# Altium project Dustbike_Core.PrjPcb
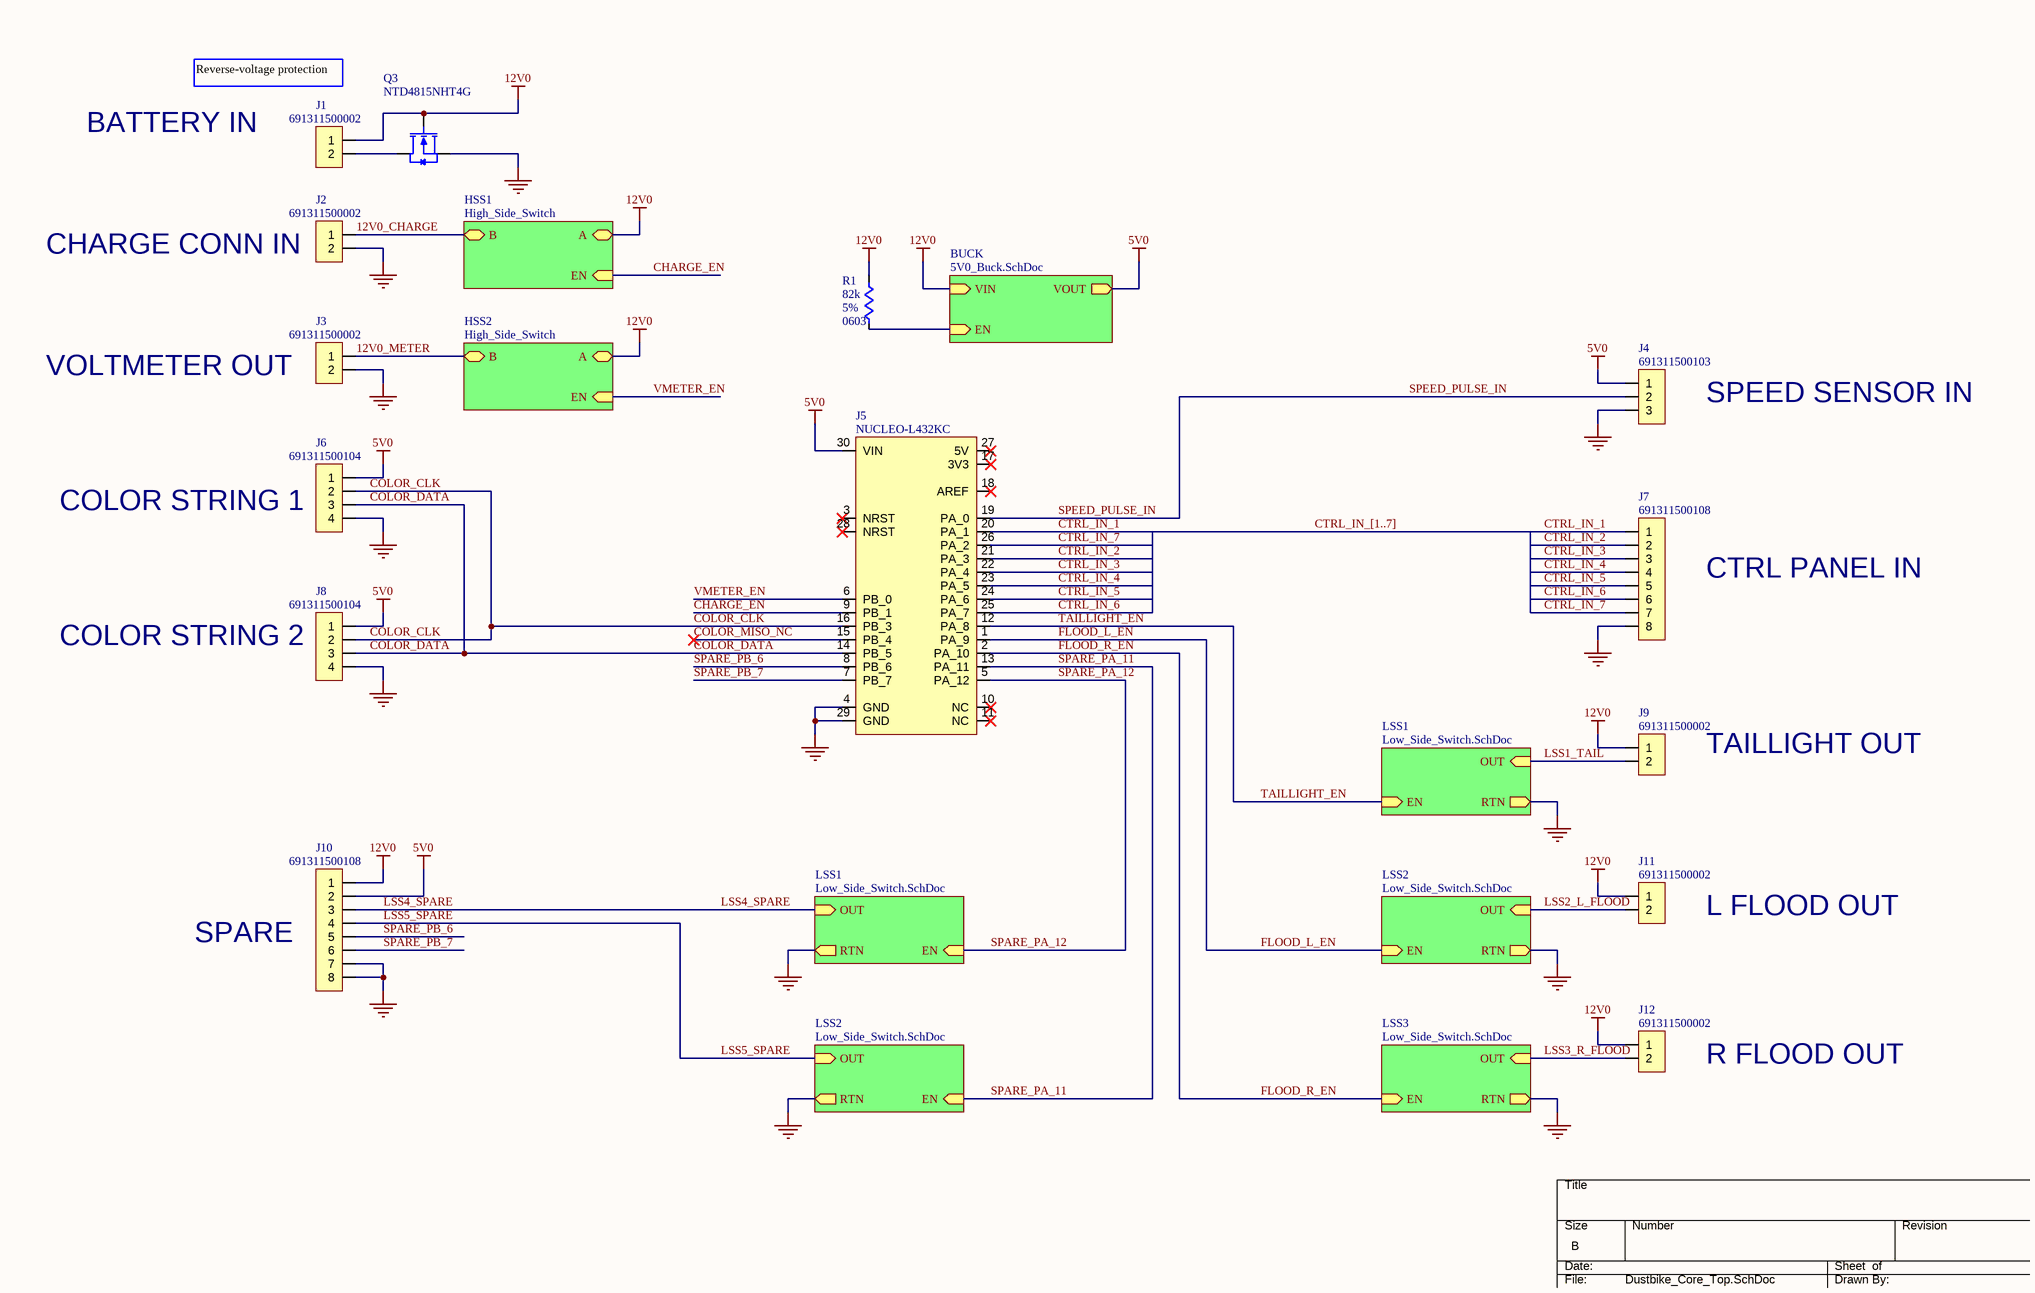
[diagram p0: Dustbike_Core_Top.SchDoc]
4 sheets, 41 parts. Net scope: hierarchical (ports join the sheet entries above them; power ports are global).
Board file: Dustbike_Core.PcbDoc
Sheets:
  Dustbike_Core_Top.SchDoc
    BUCK = 5V0_Buck.SchDoc
    LSS1 = Low_Side_Switch.SchDoc
    LSS2 = Low_Side_Switch.SchDoc
    LSS3 = Low_Side_Switch.SchDoc
    LSS1 = Low_Side_Switch.SchDoc
    LSS2 = Low_Side_Switch.SchDoc
    HSS1 = High_Side_Switch.SchDoc
    HSS2 = High_Side_Switch.SchDoc

## Sheet Dustbike_Core_Top.SchDoc: Edit Title in Document Parameters
size B; Address1: # and Street; Address2: City, State, Zip; Address3: Phone#; Address4: USA; DocumentNumber: 1; SheetNumber: 1; SheetTotal: 4; CompanyName: CompanyName; TemplateRev: D-PCD-0111-01

### Parts
J1  Manufacturer Part Number 1: 691311500002  [WURTH_691311500002]  (hidden comment: HDR_2POS)
J2  Manufacturer Part Number 1: 691311500002  [WURTH_691311500002]  (hidden comment: HDR_2POS)
J3  Manufacturer Part Number 1: 691311500002  [WURTH_691311500002]  (hidden comment: HDR_2POS)
J4  Manufacturer Part Number 1: 691311500103  [WURTH_691311500103]  (hidden comment: HDR_3POS)
J5  Manufacturer Part Number 1: NUCLEO-L432KC  [NANO_HEADER]  (hidden comment: NUCLEO_NANO)
J6  Manufacturer Part Number 1: 691311500104  [WURTH_691311500104]  (hidden comment: HDR_4POS)
J7  Manufacturer Part Number 1: 691311500108  [WURTH_691311500108]  (hidden comment: HDR_8POS)
J8  Manufacturer Part Number 1: 691311500104  [WURTH_691311500104]  (hidden comment: HDR_4POS)
J9  Manufacturer Part Number 1: 691311500002  [WURTH_691311500002]  (hidden comment: HDR_2POS)
J10  Manufacturer Part Number 1: 691311500108  [WURTH_691311500108]  (hidden comment: HDR_8POS)  (no BOM)
J11  Manufacturer Part Number 1: 691311500002  [WURTH_691311500002]  (hidden comment: HDR_2POS)
J12  Manufacturer Part Number 1: 691311500002  [WURTH_691311500002]  (hidden comment: HDR_2POS)
Q3  Manufacturer Part Number 1: NTD4815NHT4G  [DPAK228P991X238-3N_NTD4815NHT4G]  (hidden comment: NFET_SOT323)
R1  value 82k  Tolerance: 5%  Package: 0603  [RESC1508X09N]  (hidden comment: RES)

### Sub-sheets
BUCK = 5V0_Buck.SchDoc: VIN (in), VOUT (out), EN (in)
HSS1 = High_Side_Switch: A (bidir), B (bidir), EN (in)
HSS2 = High_Side_Switch: A (bidir), B (bidir), EN (in)
LSS1 = Low_Side_Switch.SchDoc: OUT (in), RTN (out), EN (in)
LSS1 = Low_Side_Switch.SchDoc: OUT (in), RTN (out), EN (in)
LSS2 = Low_Side_Switch.SchDoc: OUT (in), RTN (out), EN (in)
LSS2 = Low_Side_Switch.SchDoc: OUT (in), RTN (out), EN (in)
LSS3 = Low_Side_Switch.SchDoc: OUT (in), RTN (out), EN (in)

### Nets
5V0: J4.1 J5.30(VIN) J6.1 J8.1 J10.2 ; sheet BUCK/VOUT
12V0: J1.1 J9.1 J10.1 J11.1 J12.1 Q3.G R1.2 ; sheet BUCK/VIN, sheet HSS1/A, sheet HSS2/A
GND: J2.2 J3.2 J4.3 J5.4(GND) J5.29(GND) J6.4 J7.8 J8.4 J10.7 J10.8 Q3.S ; sheet LSS1/RTN, sheet LSS2/RTN, sheet LSS3/RTN, sheet LSS1/RTN, sheet LSS2/RTN
12V0_CHARGE: J2.1 ; sheet HSS1/B
12V0_METER: J3.1 ; sheet HSS2/B
CHARGE_EN: J5.9(PB_1) ; sheet HSS1/EN
COLOR_CLK: J5.16(PB_3) J6.2 J8.2
COLOR_DATA: J5.14(PB_5) J6.3 J8.3
COLOR_MISO_NC: J5.15(PB_4)
CTRL_IN_1: J5.20(PA_1) J7.1
CTRL_IN_2: J5.21(PA_3) J7.2
CTRL_IN_3: J5.22(PA_4) J7.3
CTRL_IN_4: J5.23(PA_5) J7.4
CTRL_IN_5: J5.24(PA_6) J7.5
CTRL_IN_6: J5.25(PA_7) J7.6
CTRL_IN_7: J5.26(PA_2) J7.7
FLOOD_L_EN: J5.1(PA_9) ; sheet LSS2/EN
FLOOD_R_EN: J5.2(PA_10) ; sheet LSS3/EN
LSS1_TAIL: J9.2 ; sheet LSS1/OUT
LSS2_L_FLOOD: J11.2 ; sheet LSS2/OUT
LSS3_R_FLOOD: J12.2 ; sheet LSS3/OUT
LSS4_SPARE: J10.3 ; sheet LSS1/OUT
LSS5_SPARE: J10.4 ; sheet LSS2/OUT
SPARE_PA_11: J5.13(PA_11) ; sheet LSS2/EN
SPARE_PA_12: J5.5(PA_12) ; sheet LSS1/EN
SPARE_PB_6: J5.8(PB_6) J10.5
SPARE_PB_7: J5.7(PB_7) J10.6
SPEED_PULSE_IN: J4.2 J5.19(PA_0)
TAILLIGHT_EN: J5.12(PA_8) ; sheet LSS1/EN
VMETER_EN: J5.6(PB_0) ; sheet HSS2/EN
NetJ1_2: J1.2 Q3.D
NetR1_1: R1.1 ; sheet BUCK/EN

Not connected (* = marked no-connect by the designer): J5 3(NRST)* 10(NC)* 11(NC)* 17(3V3)* 18(AREF)* 27(5V)* 28(NRST)*

### Buses and harness runs
bus CTRL_IN_[1..7]

### Notes on the sheet
- Reverse-voltage protection
- BATTERY IN
- CHARGE CONN IN
- VOLTMETER OUT
- SPEED SENSOR IN
- COLOR STRING 1
- CTRL PANEL IN
- COLOR STRING 2
- TAILLIGHT OUT
- SPARE
- L FLOOD OUT
- R FLOOD OUT
- 4
- 3
- 2
- 1
- D
- C
- B
- 1455 Market St., Ste 600
- A
- San Francisco, CA 94103
- WWW.SQUAREUP.COM
- SIZE
- TITLE
- PRINT DATE
- DRAWING NO.
- REVISION
- RELEASE/EDITION
- © SQUARE INC
- PROPRIETARY AND CONFIDENTIAL.
- ALL RIGHTS RESERVED. NO DUPLICATION, USE OR
- DISCLOSURES WITHOUT PRIOR WRITTEN APPROVAL.
- JIRA EPIC
- SHEET            OF

### Library data of the parts
J1-J3 J9 J11 J12 = GEN-CN-0001: TERM BLOCK HDR 2POS VERT 5.08MM; Manufacturer 1: Würth Elektronik; Connector Type: Header, Male Pins, Shrouded (2 Side); Gender: Male Pins; Number of Positions/Contacts: 2; Voltage - Rated: 300V; Current Rating: 20A; Body Color: Green; Manufacturer Part Number: *; TPN: GEN-CN-0001; Series: WR-TBL Series 3211; Mounting Type: Through Hole; Contact Material - Plating: Brass; Housing Material: Polybutylene Terephthalate (PBT); Contact Material: Brass; Operating Temperature: -40°C ~ 105°C; Supplier 1: Digi-Key; Supplier Part Number 1: 732-2052-ND; Supplier Link 1: https://www.digikey.com/en/products/detail/w%C3%BCrth-elektronik/691311500002/2060548
J4 = GEN-CN-0002: TERM BLOCK HDR 3POS VERT 5.08MM; Manufacturer 1: Würth Elektronik; Connector Type: Header, Male Pins, Shrouded (4 Side); Gender: Male Pins; Number of Positions/Contacts: 3; Voltage - Rated: 300V; Current Rating: 20A; Body Color: Green; Manufacturer Part Number: *; TPN: GEN-CN-0002; Series: WR-TBL Series 311; Mounting Type: Through Hole; Contact Material - Plating: Brass; Housing Material: Polybutylene Terephthalate (PBT); Contact Material: Brass; Operating Temperature: -40°C ~ 105°C; Supplier 1: Digi-Key; Supplier Part Number 1: 732-2059-ND; Supplier Link 1: https://www.digikey.com/en/products/detail/w%C3%BCrth-elektronik/691311500002/2060548
J5 = MOD-0001: NUCLEO-32 STM32L432KC EVAL BRD; Manufacturer 1: STMicroelectronics; TPN: MOD-0001; Supplier 1: Digi-Key; Supplier Part Number 1: 497-16592-ND; Supplier Link 1: https://www.digikey.com/en/products/detail/NUCLEO-L432KC/497-16592-ND/6132763?itemSeq=297939740
J6 J8 = GEN-CN-0003: TERM BLOCK HDR 4POS VERT 5.08MM; Manufacturer 1: Würth Elektronik; Connector Type: Header, Male Pins, Shrouded (4 Side); Gender: Male Pins; Number of Positions/Contacts: 4; Voltage - Rated: 300V; Current Rating: 20A; Body Color: Green; Manufacturer Part Number: *; TPN: GEN-CN-0003; Series: WR-TBL Series 311; Mounting Type: Through Hole; Contact Material - Plating: Brass; Housing Material: Polybutylene Terephthalate (PBT); Contact Material: Brass; Operating Temperature: -40°C ~ 105°C; Supplier 1: Digi-Key; Supplier Part Number 1: 732-2060-ND; Supplier Link 1: https://www.digikey.com/en/products/detail/w%C3%BCrth-elektronik/691311500104/2060556
J7 J10 = GEN-CN-0004: TERM BLOCK HDR 8POS VERT 5.08MM; Manufacturer 1: Würth Elektronik; Connector Type: Header, Male Pins, Shrouded (4 Side); Gender: Male Pins; Number of Positions/Contacts: 8; Voltage - Rated: 300V; Current Rating: 20A; Body Color: Green; Manufacturer Part Number: *; TPN: GEN-CN-0004; Series: WR-TBL Series 311; Mounting Type: Through Hole; Contact Material - Plating: Brass; Housing Material: Polybutylene Terephthalate (PBT); Contact Material: Brass; Operating Temperature: -40°C ~ 105°C; Supplier 1: Digi-Key; Supplier Part Number 1: 732-2063-ND; Supplier Link 1: https://www.digikey.com/en/products/detail/w%C3%BCrth-elektronik/691311500108/2060559
Q3 = NMOS-0002: MOSFET N-CH 30V 6.9A/35A DPAK; Manufacturer 1: onsemi; Type: NFET; Current - Max Continuous: 6.9A; Gate Charge (Qg) (Max) @ Vgs: 6.8 nC @ 4.5 V; Vgs (Max): 20V; Rds On (Max) @ Id, Vgs: 15mOhm @ 30A, 10V; Vgs(th) (Max) @ Id: 2.5V @ 250µA; Drive Voltage (Max Rds On, Min Rds On): 4.5V, 11.5V; TPN: NMOS-0002; Supplier 1: Digi-Key; Supplier Part Number 1: NTD4815NHT4GOSCT-ND; Drain to Source Voltage (Vdss): 30V; Gate Charge (Qg) @ Vgs: 6.8 nC @ 4.5 V; Operating Temperature: -55°C ~ 175°C (TJ); Package / Case: TO-252-3, DPak (2 Leads + Tab), SC-63; ComponentLink1URL: https://www.onsemi.com/pdf/datasheet/ntd4815nh-d.pdf; ComponentLink1Description: Datasheet; ComponentLink2URL: https://www.digikey.com/en/products/detail/onsemi/NTD4815NHT4G/1792971; ComponentLink2Description: Supplier Link
R1 = RES-SM-0288: RES 82K OHM 5% 0603; Power Rating: 0.125; Pulse-Rated: No; TPN: RES-SM-0288

## Sheet 5V0_Buck.SchDoc: Edit Title in Document Parameters
size B; Address1: # and Street; Address2: City, State, Zip; Address3: Phone#; Address4: USA; DocumentNumber: 2; SheetNumber: 2; SheetTotal: 4; CompanyName: CompanyName; TemplateRev: D-PCD-0111-01
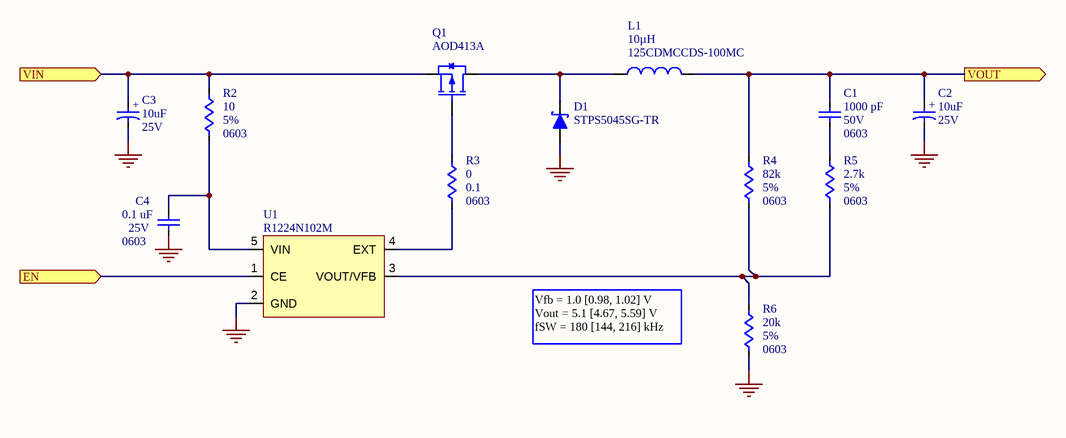
[diagram p1: 5V0_Buck.SchDoc]

### Parts
C1  value 1000 pF  Voltage-Rated: 50V  Package / Case: 0603  [CAPC1608X09N]  (hidden comment: CAP)
C2  value 10uF  Voltage-Rated: 25V  [CAP_TH_5X12_L5]  (hidden comment: CAP-POL)
C3  value 10uF  Voltage-Rated: 25V  [CAP_TH_5X12_L5]  (hidden comment: CAP-POL)
C4  value 0.1 uF  Voltage-Rated: 25V  Package / Case: 0603  [CAPC1608X09N]  (hidden comment: CAP)
D1  Manufacturer Part Number 1: STPS5045SG-TR  [DPAK254P1540X460-3N_STPS5045SG-TR]  (hidden comment: DIO-Schottky_STPS8L30B-TR)
L1  Inductance: 10µH  [125CDMCCDS-100MC]  (hidden comment: INDUCTOR)
Q1  Manufacturer Part Number 1: AOD413A  [DPAK228P991X238-3N_AOD413A]  (hidden comment: PFET_SOT323)
R2  value 10  Tolerance: 5%  Package: 0603  [RESC1508X09N]  (hidden comment: RES)
R3  value 0  Power Rating: 0.1  Package: 0603  [RESC1508X09N]  (hidden comment: RES)
R4  value 82k  Tolerance: 5%  Package: 0603  [RESC1508X09N]  (hidden comment: RES)
R5  value 2.7k  Tolerance: 5%  Package: 0603  [RESC1508X09N]  (hidden comment: RES)
R6  value 20k  Tolerance: 5%  Package: 0603  [RESC1508X09N]  (hidden comment: RES)
U1  R1224N102M  [SOT95P280X120-5N_R1224N102M]

### Ports
EN (in), VIN (in), VOUT (out)

### Nets
5V0: C1.1 C2.1 L1.2 R4.2 ; port VOUT
12V0: C3.1 Q1.S R2.2 ; port VIN
GND: C2.2 C3.2 C4.2 D1.A R6.1 U1.2(GND)
NetC1_2: C1.2 R5.1
NetC4_1: C4.1 R2.1 U1.5(VIN)
NetD1_K: D1.K L1.1 Q1.D
NetQ1_G: Q1.G R3.2
NetR1_1: U1.1(CE) ; port EN
NetR3_1: R3.1 U1.4(EXT)
NetR4_1: R4.1 R5.2 R6.2 U1.3(VOUT/VFB)

Not connected (* = marked no-connect by the designer): D1 NC

### Notes on the sheet
- Vfb = 1.0 [0.98, 1.02] V
  Vout = 5.1 [4.67, 5.59] V
  fSW = 180 [144, 216] kHz
- 4
- 3
- 2
- 1
- D
- C
- B
- 1455 Market St., Ste 600
- A
- San Francisco, CA 94103
- WWW.SQUAREUP.COM
- SIZE
- TITLE
- PRINT DATE
- DRAWING NO.
- REVISION
- RELEASE/EDITION
- © SQUARE INC
- PROPRIETARY AND CONFIDENTIAL.
- ALL RIGHTS RESERVED. NO DUPLICATION, USE OR
- DISCLOSURES WITHOUT PRIOR WRITTEN APPROVAL.
- JIRA EPIC
- SHEET            OF
- (in symbol CAP-TH-0001) +
- (in symbol CAP-TH-0004) +

### Library data of the parts
C1 = CAP-SMT-0004: CAP CER 1000PF 50V X7R 0603; Manufacturer 1: Samsung Electro-Mechanics; Manufacturer Part Number 1: CL10B102KB8NNNC; Tolerance: 10%; TPN: CAP-SMT-0004; Temperature Coefficient: X7R; Operating Temperature: -55°C ~ 125°C; Size / Dimension: 0.063" L x 0.031" W (1.60mm x 0.80mm); Supplier 1: Digi-Key; Supplier Part Number 1: 1276-1018-1-ND; Supplier Link 1: https://www.digikey.com/en/products/detail/samsung-electro-mechanics/CL10B102KB8NNNC/3886676
C2 = CAP-TH-0004: CAP ALUM 47UF 20% 25V RADIAL; Manufacturer 1: KEMET; Manufacturer Part Number 1: ESK476M025AC3FA; Lifetime @ Temp: 2000; Polarization: Polar; Ripple Current @ Low Frequency: 135 mA @ 120 Hz; Ripple Current @ High Frequency: 202.5 mA @ 10 kHz; TPN: CAP-TH-0004; Tolerance: 20%; ESR: -; Operating Temperature: -40°C ~ 85°C; Lead Spacing: 0.197" (5.00mm); Size / Dimension: 0.197" Dia (5.00mm)); Height - Seated (Max): 0.492"(12.5mm); Mounting Type: Through Hole; Package / Case: Radial, Can; Supplier 1: Digi-Key; Supplier Part Number 1: 399-ESK476M025AC3FACT-ND; Supplier Link 1: https://www.digikey.com/en/products/detail/kemet/ESK476M025AC3FA/13979958
C3 = CAP-TH-0001: CAP ALUM 10UF 20% 25V RADIAL; Manufacturer 1: Panasonic Electronic Components; Manufacturer Part Number 1: ECA-1EM100B; Lifetime @ Temp: 2000; Polarization: Polar; Ripple Current @ Low Frequency: 50mA @ 120Hz; Ripple Current @ High Frequency: 85mA @ 10kHz; TPN: CAP-TH-0001; Tolerance: 20%; ESR: -; Operating Temperature: -40°C ~ 85°C; Lead Spacing: 0.197" (5.00mm); Size / Dimension: 0.197" Dia (5.00mm)); Height - Seated (Max): 0.472" (12.00mm); Mounting Type: Through Hole; Package / Case: Radial, Can; Supplier 1: Digi-Key; Supplier Part Number 1: P19522CT-ND; Supplier Link 1: https://www.digikey.com/product-detail/en/panasonic-electronic-components/ECA-1EM100B/P19522CT-ND/6109420
C4 = CAP-SMT-0001: CAP CER 0.1UF 25V X5R 0603; Manufacturer 1: Samsung Electro-Mechanics; Manufacturer Part Number 1: CL10A104KA8NNNC; Tolerance: 20%; TPN: CAP-SMT-0001; Temperature Coefficient: X5R; Operating Temperature: -55°C ~ 85°C; Size / Dimension: 0.063" L x 0.031" W (1.60mm x 0.80mm); Supplier 1: Digi-Key; Supplier Part Number 1: 1276-1857-1-ND; Supplier Link 1: http://www.samsungsem.com/kr/support/product-search/mlcc/CL10A104KA8NNNC.jsp; Manufacturer 2: Taiyo Yuden; Manufacturer Part Number 2: EMK107BJ104KAHT; Supplier 2: Digi-Key; Supplier Part Number 2: 587-3308-1-ND
D1 = DIO-GEN-0003: DIODE SCHOTTKY 45V 50A D2PAK; Manufacturer 1: STMicroelectronics; Voltage - Forward (Vf) (Max) @ If: 610mV @ 50A; Speed: Fast Recovery =< 500ns, > 200mA (Io); Current - Reverse Leakage @ Vr: 360µA @ 45V; TPN: DIO-GEN-0003; Voltage - DC Reverse (Vr) (Max): 45V; Current - Average Rectified (Io): 50A; Mounting Type: Surface Mount; Package / Case: TO-263-3, D²Pak (2 Leads + Tab), TO-263AB; Supplier Device Packaging: D²PAK; Operating Temperature - Junction: 200°C (Max); Supplier 1: Digi-Key; Supplier Part Number 1: 497-13279-1-ND; Supplier 1 Link: https://www.digikey.com/en/products/detail/stmicroelectronics/STPS5045SG-TR/3661704
L1 = IND-0001: FIXED IND 10UH 9A 22 MOHM SMD; Manufacturer 1: Sumida America Components Inc.; Tolerance: ±20%; Current - Saturation (Isat): 14A; Shielding: Shielded; DC Resistance (DCR): 22mΩ Max; Inductance Frequency - Test: 100 kHz; TPN: IND-0001; Current Rating (Amps): 9A; Operating Temperature: -55°C ~ 125°C; Mounting Type: Surface Mount; Package / Case: Nonstandard; Supplier Device Package: SMD; Size / Dimension: 0.530" L x 0.496" W (13.45mm x 12.60mm); Height - Seated (Max): 0.197" (5.00MM); Manufacturer Part Number 1: 125CDMCCDS-100MC; Supplier 1: Digi-Key; Supplier Part Number 1: 308-2561-1-ND
Q1 = PMOS-0001: MOSFET P-CH 40V 12A TO252; Manufacturer 1: Alpha & Omega Semiconductor Inc.; Type: P-Channel; Current - Continuous Drain (Id): 12A (Tc); Gate Charge (Qg) (Max) @ Vgs: 21nC @ 10V; Vgs (Max): ±20V; Rds On (Max) @ Id, Vgs: 44mOhm @ 12A, 10V; Vgs(th) (Max) @ Id: 3V @ 250µA; Drive Voltage (Max Rds On, Min Rds On): 4.5V, 10V; TPN: PMOS-0001; Supplier 1: Digi-Key; Supplier Part Number 1: 785-1218-1-ND; Drain to Source Voltage (Vdss): 40V; Operating Temperature: -55°C ~ 175°C (TJ); Package / Case: TO-252-3, DPak (2 Leads + Tab), SC-63; ComponentLink1URL: http://aosmd.com/res/data_sheets/AOD413A.pdf; ComponentLink1Description: Datasheet; ComponentLink2URL: https://www.digikey.com/en/products/detail/alpha-omega-semiconductor-inc/AOD413A/2353883; ComponentLink2Description: Supplier Link
R2 = RES-SM-0194: RES 10 OHM 5% 0603; Power Rating: 0.125; Pulse-Rated: No; TPN: RES-SM-0194
R3 = RES-SM-0677: RES 0 OHM JUMPER 1/10W 0603; Manufacturer 1: Stackpole Electronics Inc; Manufacturer Part Number 1: RMCF0603ZT0R00; Pulse-Rated: No; TPN: RES-SM-0677; Supplier 1: Digi-Key; Supplier Part Number 1: RMCF0603ZT0R00TR-ND; Supplier Link 1: https://www.seielect.com/Catalog/SEI-RMCF_RMCP.pdf; Manufacturer 2: Yageo; Manufacturer Part Number 2: RC0603JR-070RL; Supplier 2: Digi-Key; Supplier Part Number 2: 311-0.0GRTR-ND
R4 = RES-SM-0288: as R1 on sheet Dustbike_Core_Top; TPN: RES-SM-0288
R5 = RES-SM-0252: RES 2.7K OHM 5% 0603; Power Rating: 0.125; Pulse-Rated: No; TPN: RES-SM-0252
R6 = RES-SM-0273: RES 20K OHM 5% 0603; Power Rating: 0.125; Pulse-Rated: No; TPN: RES-SM-0273
U1 = ICS-DSC-0002: PWM/VFM STEP-DOWN DCDC CONTROLLE; Manufacturer 1: Nisshinbo Micro Devices Inc.; Manufacturer Part Number 1: R1224N102M-TR-FE; Output Type: Transistor Driver; Output Configuration: Postive; Topology: Buck; Number of Outputs: 1; Voltage - Supply: 2.3v ~ 18.5v; Frequency -  Switching: 180KhZ; Synchronous Rectifier: No; Control Features: Enable; TPN: ICS-DSC-0002; Function: Step-Down; Output Phases: 1; Duty Cycle (Max): 1; Clock Sync: No; Serial Interfaces: -; Operating Temperature: -40°C ~ 85°C; Mounting Type: Surface Mount; Package / Case: SC-74A, SOT-753; Supplier Device Package: SOT-23-5; Supplier 1: Digi-Key; Supplier Part Number 1: 2129-R1224N102M-TR-FECT-ND; Supplier Link 1: https://www.digikey.com/en/products/detail/nisshinbo-micro-devices-inc/R1224N102M-TR-FE/10244897?utm_medium=buyNow&utm_source=FindChips

## Sheet Low_Side_Switch.SchDoc: Edit Title in Document Parameters
size B; Address1: # and Street; Address2: City, State, Zip; Address3: Phone#; Address4: USA; DocumentNumber: 3; SheetNumber: 3; SheetTotal: 4; CompanyName: CompanyName; TemplateRev: D-PCD-0111-01
Used 5 times, as channels LSS1, LSS2, LSS3, LSS1, LSS2. Parts and nets are listed once, with the designators drawn on the sheet.
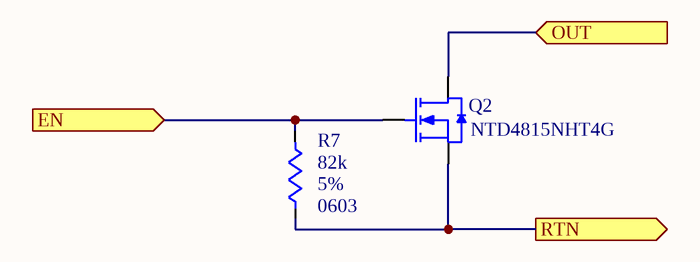
[diagram p2: Low_Side_Switch.SchDoc]

### Parts
Q2  Manufacturer Part Number 1: NTD4815NHT4G  [DPAK228P991X238-3N_NTD4815NHT4G]  (hidden comment: NFET_SOT323)
R7  value 82k  Tolerance: 5%  Package: 0603  [RESC1508X09N]  (hidden comment: RES)

### Ports
EN (in), OUT (in), RTN (out)

### Nets
EN: Q2.G R7.2 ; port EN
OUT: Q2.D ; port OUT
RTN: Q2.S R7.1 ; port RTN

### Channels
LSS1: designators Q2=Q2_LSS12 R7=R7_LSS1#1; ports EN=TAILLIGHT_EN OUT=LSS1_TAIL RTN=GND
LSS2: designators Q2=Q2_LSS22 R7=R7_LSS2#1; ports EN=FLOOD_L_EN OUT=LSS2_L_FLOOD RTN=GND
LSS3: designators end in _LSS3; ports EN=FLOOD_R_EN OUT=LSS3_R_FLOOD RTN=GND
LSS1: designators Q2=Q2_LSS11 R7=R7_LSS1#2; ports EN=SPARE_PA_12 OUT=LSS4_SPARE RTN=GND
LSS2: designators Q2=Q2_LSS21 R7=R7_LSS2#2; ports EN=SPARE_PA_11 OUT=LSS5_SPARE RTN=GND

### Notes on the sheet
- 4
- 3
- 2
- 1
- D
- C
- B
- 1455 Market St., Ste 600
- A
- San Francisco, CA 94103
- WWW.SQUAREUP.COM
- SIZE
- TITLE
- PRINT DATE
- DRAWING NO.
- REVISION
- RELEASE/EDITION
- © SQUARE INC
- PROPRIETARY AND CONFIDENTIAL.
- ALL RIGHTS RESERVED. NO DUPLICATION, USE OR
- DISCLOSURES WITHOUT PRIOR WRITTEN APPROVAL.
- JIRA EPIC
- SHEET            OF

### Library data of the parts
Q2 = NMOS-0002: as Q3 on sheet Dustbike_Core_Top; TPN: NMOS-0002; Supplier 1: Digi-Key; Supplier Part Number 1: NTD4815NHT4GOSCT-ND; Drain to Source Voltage (Vdss): 30V; Gate Charge (Qg) @ Vgs: 6.8 nC @ 4.5 V; Operating Temperature: -55°C ~ 175°C (TJ); Package / Case: TO-252-3, DPak (2 Leads + Tab), SC-63; ComponentLink1URL: https://www.onsemi.com/pdf/datasheet/ntd4815nh-d.pdf; ComponentLink1Description: Datasheet; ComponentLink2URL: https://www.digikey.com/en/products/detail/onsemi/NTD4815NHT4G/1792971; ComponentLink2Description: Supplier Link
R7 = RES-SM-0288: as R1 on sheet Dustbike_Core_Top; TPN: RES-SM-0288

## Sheet High_Side_Switch.SchDoc
size B; DocumentNumber: 4; SheetNumber: 4; SheetTotal: 4
Used 2 times, as channels HSS1, HSS2. Parts and nets are listed once, with the designators drawn on the sheet.
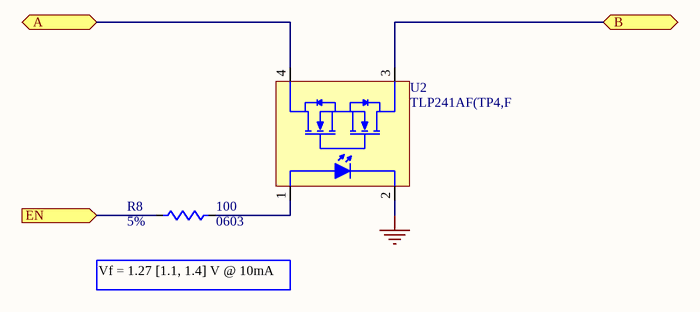
[diagram p3: High_Side_Switch.SchDoc]

### Parts
R8  value 100  Tolerance: 5%  Package: 0603  [RESC1508X09N]  (hidden comment: RES)
U2  Manufacturer Part Number 1: TLP241AF(TP4,F  [SOP254P1000X425-4N_TLP241AF]  (hidden comment: SSR_SPST-NO)

### Ports
A (bidir), B (bidir), EN (in)

### Nets
GND: U2.2
A: U2.4 ; port A
B: U2.3 ; port B
EN: R8.1 ; port EN
NetR8_2: R8.2 U2.1

### Channels
HSS1: designators end in _HSS1; ports A=12V0 B=12V0_CHARGE EN=CHARGE_EN
HSS2: designators end in _HSS2; ports A=12V0 B=12V0_METER EN=VMETER_EN

### Notes on the sheet
- (near R8) Vf = 1.27 [1.1, 1.4] V @ 10mA

### Library data of the parts
R8 = RES-SM-0218: RES 100 OHM 5% 0603; Power Rating: 0.125; Pulse-Rated: No; TPN: RES-SM-0218
U2 = SSR-0001: SSR RELAY SPST-NO 2A 0-40V; Manufacturer 1: Toshiba Semiconductor and Storage; Voltage-Input: 1.27VDC; Voltage - Load: 0V ~ 40V; On-State Resistance (Max): 150mΩ; TPN: SSR-0001; Supplier 1: Digi-Key; Supplier Part Number 1: TLP241AF(TP4FCT-ND; Current - Max Continuous: 2A; Package / Case: 4-SMD (0.400", 10.16mm); ComponentLink1URL: https://toshiba.semicon-storage.com/info/docget.jsp?did=14237&prodName=TLP241A; ComponentLink1Description: Datasheet; ComponentLink2URL: https://www.digikey.com/en/products/detail/toshiba-semiconductor-and-storage/TLP241AF-TP4-F/7652708; ComponentLink2Description: Supplier Link

## Nets that join several sheets
5V0: Dustbike_Core_Top (5 pins), 5V0_Buck (C1.1 C2.1 L1.2 R4.2)
12V0: Dustbike_Core_Top (7 pins), 5V0_Buck (C3.1 Q1.S R2.2), HSS1 (U2_HSS1.4), HSS2 (U2_HSS2.4)
GND: Dustbike_Core_Top (11 pins), 5V0_Buck (6 pins), LSS1 (Q2_LSS12.S R7_LSS1#1.1), LSS2 (Q2_LSS22.S R7_LSS2#1.1), LSS3 (Q2_LSS3.S R7_LSS3.1), LSS1 (Q2_LSS11.S R7_LSS1#2.1), LSS2 (Q2_LSS21.S R7_LSS2#2.1), HSS1 (U2_HSS1.2), HSS2 (U2_HSS2.2)
12V0_CHARGE: Dustbike_Core_Top (J2.1), HSS1 (U2_HSS1.3)
12V0_METER: Dustbike_Core_Top (J3.1), HSS2 (U2_HSS2.3)
CHARGE_EN: Dustbike_Core_Top (J5.9), HSS1 (R8_HSS1.1)
FLOOD_L_EN: Dustbike_Core_Top (J5.1), LSS2 (Q2_LSS22.G R7_LSS2#1.2)
FLOOD_R_EN: Dustbike_Core_Top (J5.2), LSS3 (Q2_LSS3.G R7_LSS3.2)
LSS1_TAIL: Dustbike_Core_Top (J9.2), LSS1 (Q2_LSS12.D)
LSS2_L_FLOOD: Dustbike_Core_Top (J11.2), LSS2 (Q2_LSS22.D)
LSS3_R_FLOOD: Dustbike_Core_Top (J12.2), LSS3 (Q2_LSS3.D)
LSS4_SPARE: Dustbike_Core_Top (J10.3), LSS1 (Q2_LSS11.D)
LSS5_SPARE: Dustbike_Core_Top (J10.4), LSS2 (Q2_LSS21.D)
NetR1_1: Dustbike_Core_Top (R1.1), 5V0_Buck (U1.1)
SPARE_PA_11: Dustbike_Core_Top (J5.13), LSS2 (Q2_LSS21.G R7_LSS2#2.2)
SPARE_PA_12: Dustbike_Core_Top (J5.5), LSS1 (Q2_LSS11.G R7_LSS1#2.2)
TAILLIGHT_EN: Dustbike_Core_Top (J5.12), LSS1 (Q2_LSS12.G R7_LSS1#1.2)
VMETER_EN: Dustbike_Core_Top (J5.6), HSS2 (R8_HSS2.1)